# Altium schematic sheet Slave.SchDoc: Slave
size Letter
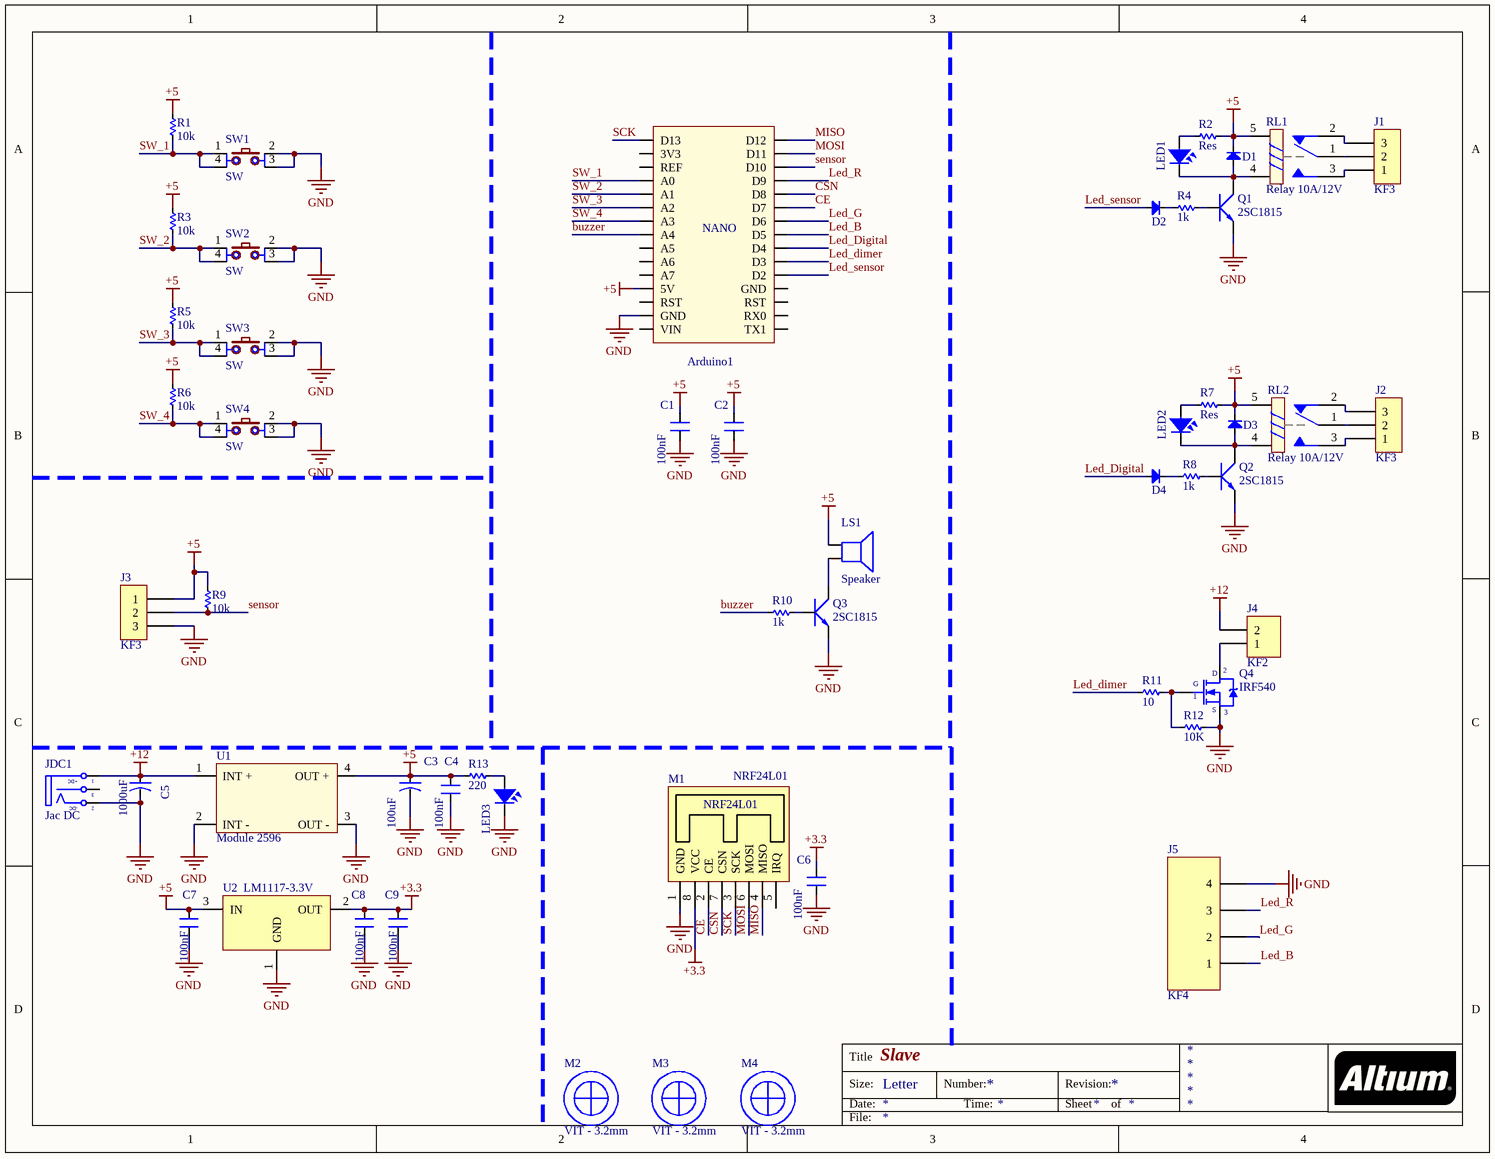
[diagram p0: Slave.SchDoc]

## Parts
Arduino1  Arduino Nano  [Arduino Nano]  (value not drawn)
C1  100nF  [CN1.5]
C2  100nF  [CN1.5]
C3  100uF  [CA-ALU-5]
C4  100nF  [CN1.5]
C5  1000uF  [CA-ALU-6.3]
C6  100nF  [CN1.5]
C7  100nF  [CN-SMD-0603]
C8  100nF  [CN-SMD-0603]
C9  100nF  [CN-SMD-0603]
D1  Diode  [DIO-1A]  (value not drawn)
D2  Diode  [DIO-1A]  (value not drawn)
D3  Diode  [DIO-1A]  (value not drawn)
D4  Diode  [DIO-1A]  (value not drawn)
J1  KF3  [KF3-5.08]
J2  KF3  [KF3-5.08]
J3  KF3  [KF3-5.08]
J4  KF2  [KF2-5.08]
J5  KF4  [KF4-5.08]
JDC1  Jac DC  [DC0]
LED1  LED  [LED-5-Green]  (value not drawn)
LED2  LED  [LED-5-Green]  (value not drawn)
LED3  LED  [LED-3MM-RED]  (value not drawn)
LS1  Speaker  [SPEAKER]
M1  NRF24L01  [NRF24L01]
M2  VIT - 3.2mm  [VIT - 3.2MM_2]
M3  VIT - 3.2mm  [VIT - 3.2MM_2]
M4  VIT - 3.2mm  [VIT - 3.2MM_2]
Q1  2SC1815  [TO92-123]
Q2  2SC1815  [TO92-123]
Q3  2SC1815  [TO92-123]
Q4  IRF540  [TO220-123]
R1  10k  [RES-1/4W]
R2  Res  [RES-1/4W-SMALL]
R3  10k  [RES-1/4W]
R4  1k  [RES-1/4W-SMALL]
R5  10k  [RES-1/4W]
R6  10k  [RES-1/4W]
R7  Res  [RES-1/4W-SMALL]
R8  1k  [RES-1/4W-SMALL]
R9  10k  [RES-1/4W]
R10  1k  [RES-1/4W-SMALL]
R11  10  [RES-1/4W-SMALL]
R12  10K  [RES-1/4W-SMALL]
R13  220  [RES-1/4WD]
RL1  Relay 10A/12V  [RELAY 5]
RL2  Relay 10A/12V  [RELAY 5]
SW1  SW  [SW2-DIP]
SW2  SW  [SW2-DIP]
SW3  SW  [SW2-DIP]
SW4  SW  [SW2-DIP]
U1  Module 2596  [Module 2596]
U2  LM1117-3.3V  [SOT223]

## Nets
+3.3: C6.2 C8.2 C9.2 M1.8(VCC) U2.2(OUT)
+5: Arduino1.5V C1.2 C2.2 C3.1 C4.2 C7.2 D1.2(K) D3.2(K) J3.1 LS1.1 R1.1 R2.1 R3.1 R5.1 R6.1 R7.1 R9.1 R13.2 RL1.5 RL2.5 U1.4(OUT_+) U2.3(IN)
+12: C5.1 J4.2 JDC1.1(T) U1.1(INT_+)
GND: Arduino1.GND C1.1 C2.1 C3.2 C4.1 C5.2 C6.1 C7.1 C8.1 C9.1 J3.3 J5.4 JDC1.2(TN) LED3.2 M1.1(GND) Q1.1(E) Q2.1(E) Q3.1(E) Q4.3(S) R12.1 SW1.2 SW1.3 SW2.2 SW2.3 SW3.2 SW3.3 SW4.2 SW4.3 U1.2(INT_-) U1.3(OUT_-) U2.1(GND)
buzzer: Arduino1.A4 R10.2
CE: Arduino1.D7 M1.2(CE)
CSN: Arduino1.D8 M1.7(CSN)
Led_B: Arduino1.D5 J5.1
Led_Digital: Arduino1.D4 D4.1(A)
Led_dimer: Arduino1.D3 R11.2
Led_G: Arduino1.D6 J5.2
Led_R: Arduino1.D9 J5.3
Led_sensor: Arduino1.D2 D2.1(A)
MISO: Arduino1.D12 M1.4(MISO)
MOSI: Arduino1.D11 M1.6(MOSI)
SCK: Arduino1.D13 M1.3(SCK)
sensor: Arduino1.D10 J3.2 R9.2
SW_1: Arduino1.A0 R1.2 SW1.1 SW1.4
SW_2: Arduino1.A1 R3.2 SW2.1 SW2.4
SW_3: Arduino1.A2 R5.2 SW3.1 SW3.4
SW_4: Arduino1.A3 R6.2 SW4.1 SW4.4
NetD1_1: D1.1(A) LED1.2 Q1.2(C) RL1.4
NetD2_2: D2.2(K) R4.2
NetD3_1: D3.1(A) LED2.2 Q2.2(C) RL2.4
NetD4_2: D4.2(K) R8.2
NetJ1_1: J1.1 RL1.3
NetJ1_2: J1.2 RL1.1
NetJ1_3: J1.3 RL1.2
NetJ2_1: J2.1 RL2.3
NetJ2_2: J2.2 RL2.1
NetJ2_3: J2.3 RL2.2
NetJ4_1: J4.1 Q4.2(D)
NetLED1_1: LED1.1 R2.2
NetLED2_1: LED2.1 R7.2
NetLED3_1: LED3.1 R13.1
NetLS1_2: LS1.2 Q3.2(C)
NetQ1_3: Q1.3(B) R4.1
NetQ2_3: Q2.3(B) R8.1
NetQ3_3: Q3.3(B) R10.1
NetQ4_1: Q4.1(G) R11.1 R12.2

Not connected (* = marked no-connect by the designer): Arduino1 3V3 A5 A6 A7 REF RST RX0 TX1 VIN; JDC1 3(S); M1 5(IRQ)

## Notes on the sheet
- Title
- Size:
- Date:
- Letter
- Number:
- Time:
- Revision:
- Sheet
- of
- File:
- (in symbol Arduino Nano) NANO
- (in symbol DCIN) +DC; -DC

## Library data of the parts
Arduino1 = Arduino Nano: Value: Cau 1A
C1 C2 C4 C6-C9 = CN: Value: 33pF
C3 C5 = CN-ALU-DIP: Capacitor (Semiconductor SIM Model); Value: 104; LatestRevisionDate: 17-Jul-2002; LatestRevisionNote: Re-released for DXP Platform.; PackageReference: C1206; Publisher: Altium Limited
D1-D4 = Diode: Default Diode; Code - JEDEC: DO-214-AB; Value: 1N5007; Published: 8-Jun-2000; Revision: July-2002: Re-released for DXP Platform.; Publisher: Altium Limited
J1-J3 = KF3: Manufacturer: Würth Elektronik eiSos GmbH; partNo: 691103110003; ComponentLink1 Description: Manufacturer; ComponentLink2 Description: Datasheet; NoPins: 3; Created Date: 29 October 2013; ComponentLink1URL: http://www.we-online.com; ComponentLink2URL: http://katalog.we-online.de/em/datasheet/6911031100xx.pdf; Created by: Karrer Zheng
J4 = KF2: Manufacturer: Würth Elektronik eiSos GmbH; partNo: 691103110002; ComponentLink1 Description: Manufacturer; ComponentLink2 Description: Datasheet; NoPins: 2; Created Date: 29 October 2013; ComponentLink1URL: http://www.we-online.com; ComponentLink2URL: http://katalog.we-online.de/em/datasheet/6911031100xx.pdf; Created by: Karrer Zheng
J5 = KF4: Manufacturer: W¨¹rth Elektronik eiSos GmbH; PartNo: 691133710004; ComponentLink1 Description: Manufacturer; ComponentLink2 Description: Datasheet; NoPins: 4; ComponentLink1 URL: http://www.we-online.com; ComponentLink2 URL: http://katalog.we-online.de/em/datasheet/6911337100xx.pdf; Created By: Baojun Chen; Created Date: 4-Aug-15
JDC1 = DCIN: Jac DC input; Value: Jac DC
LED1-LED3 = LED: LED Single colour Green and Red; Value: LED 3 ly Single Colour
LS1 = Speaker: Loudspeaker; Published: 24-Mar-1999; LatestRevisionDate: 17-Jul-2002; LatestRevisionNote: Re-released for DXP Platform.; PackageReference: PIN2; Publisher: Altium Limited
Q1-Q3 = 2SC1815: NPN 600mW, ECB; Value: C1815
Q4 = IRF840: MOSFET N - CHANNEL 500V - 0.75 - 8A - TO-220; Value: IRF840
R1-R13 = Res: Manufacturer: Generic Components; Class: Passive; SubClass: R; Published: 08/06/2000; Publisher: Altium Hobart Technology Centre
RL1 RL2 = Relay 5: Relay SPDT,10A - 12VDC 5 Pin; Value: Relay SPDT, 10A, 12V
SW1-SW4 = SW4: Switch button 4 pin; Value: Button chip 4 pin
U2 = LM1117: 800mA Low-Dropout Linear Regulator; Creator: Nguyen Ba Bien; Website: http://group3i.net